# Altium schematic sheet Power_Supply.SchDoc
size A3; SheetNumber: 4; SheetTotal: 9
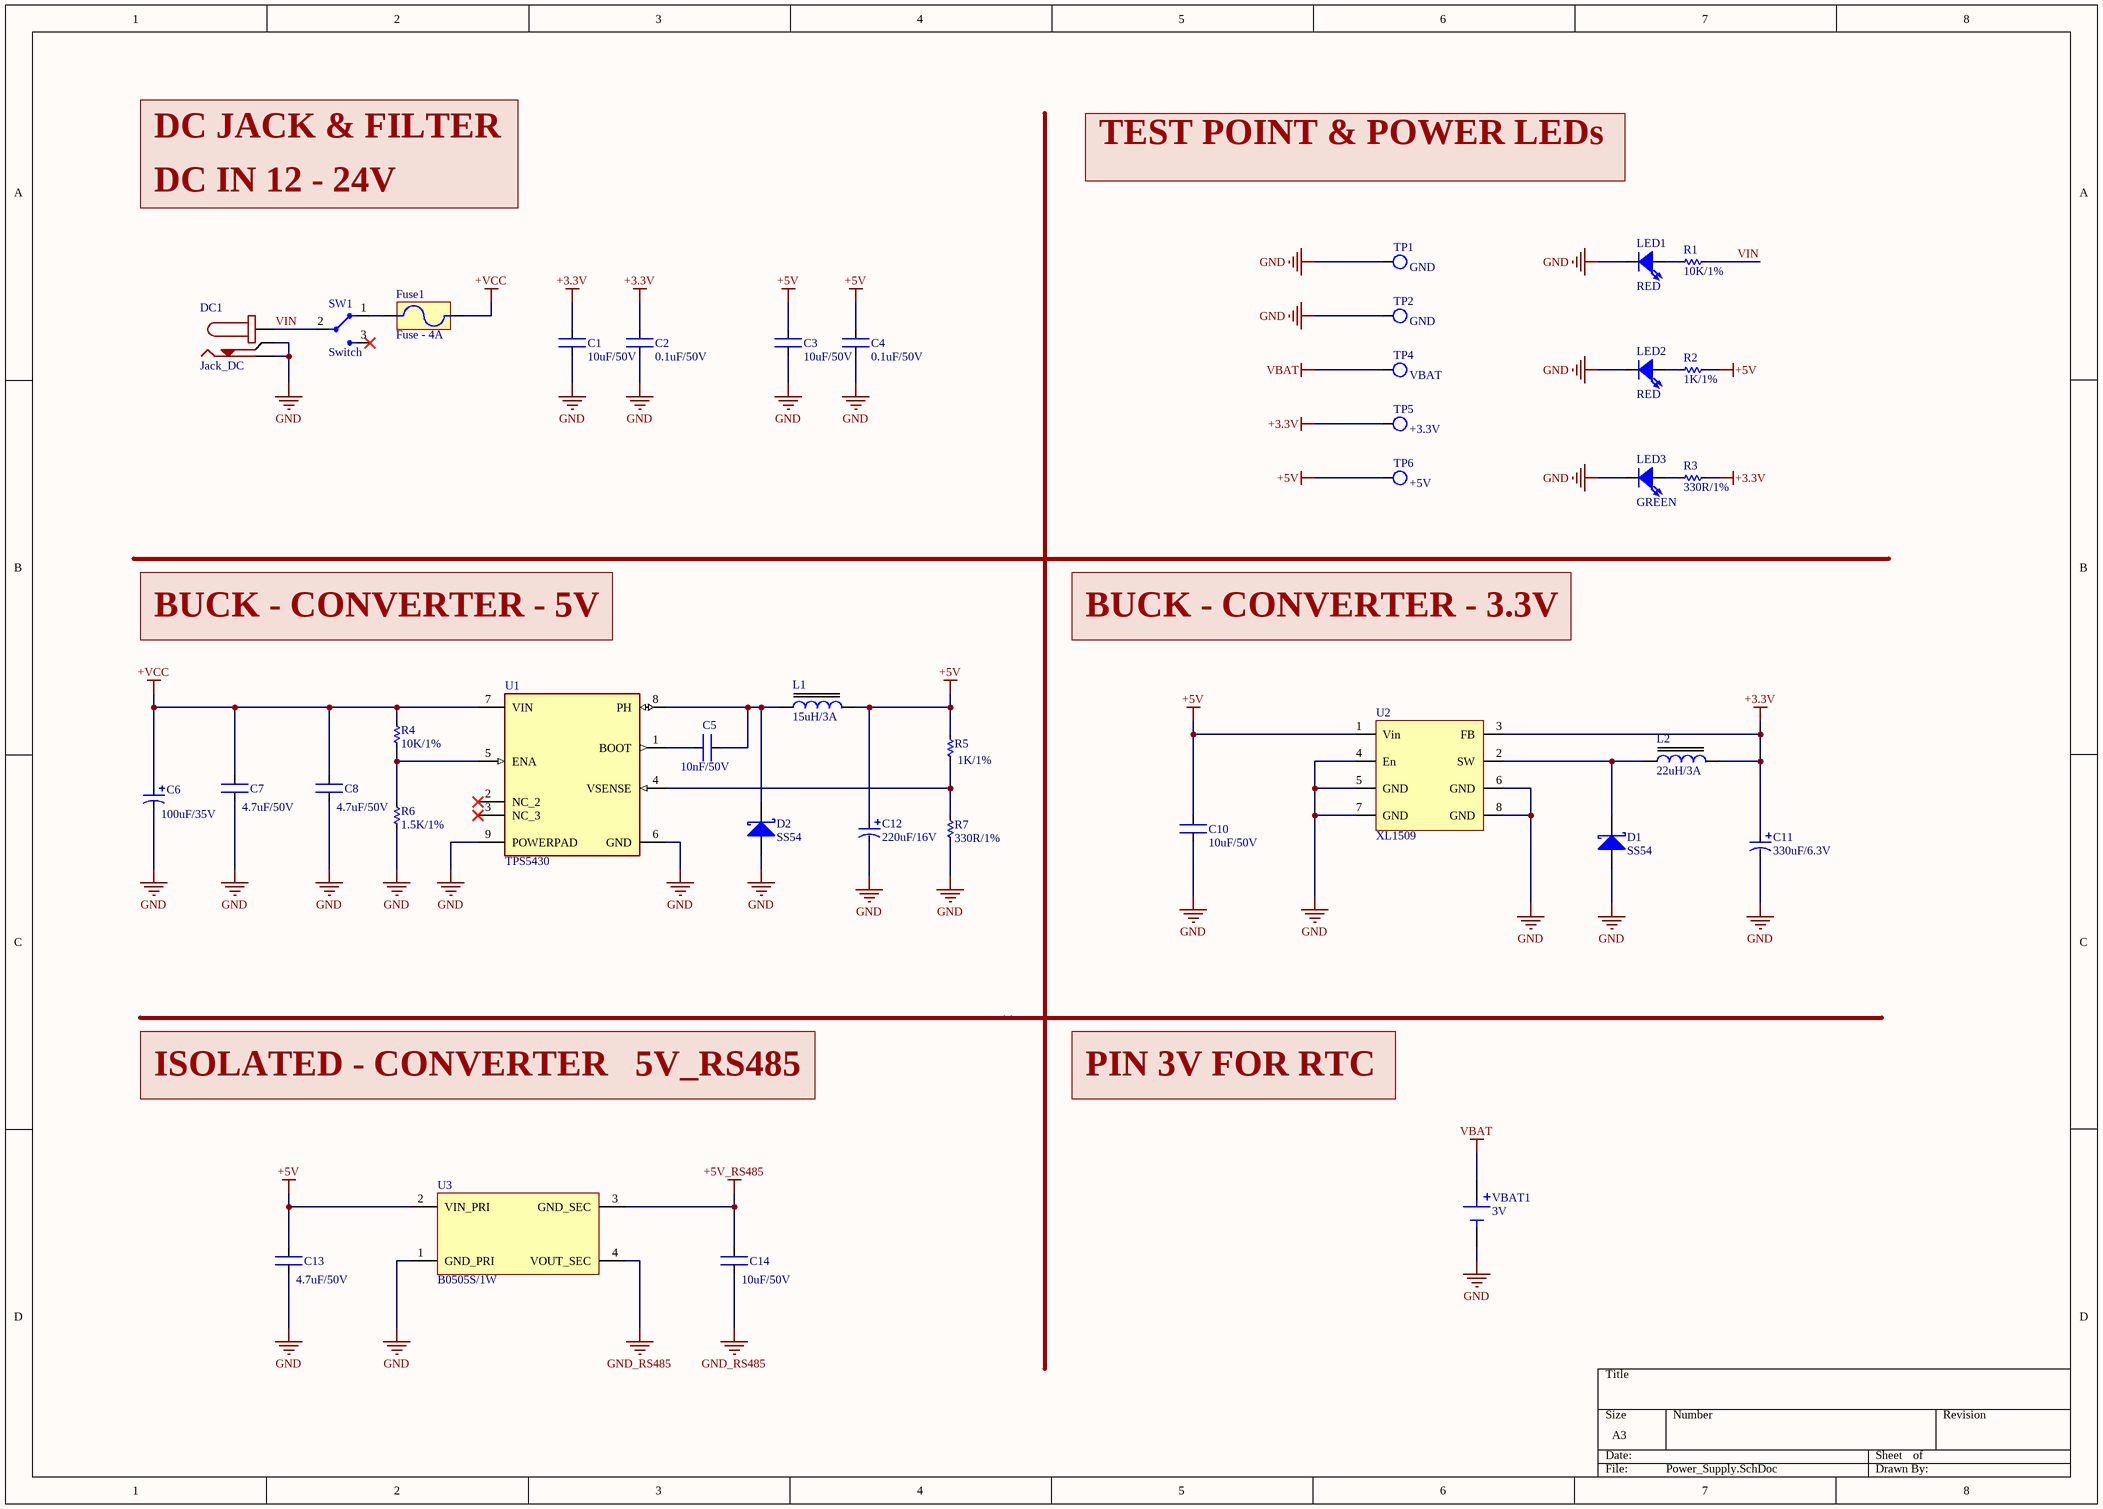
[diagram p0: Power_Supply.SchDoc]

## Parts
C1  10uF/50V  [CAP - 0603]
C2  0.1uF/50V  [CAP - 0603]
C3  10uF/50V  [CAP - 0603]
C4  0.1uF/50V  [CAP - 0603]
C5  10nF/50V  [CAP - 0603]
C6  100uF/35V  [Alu_Cap_6.3_7.7]
C7  4.7uF/50V  [CAP - 0603]
C8  4.7uF/50V  [CAP - 0603]
C10  10uF/50V  [CAP - 0603]
C11  330uF/6.3V  [Alu_Cap_6.3_7.7]
C12  220uF/16V  [Alu_Cap_6.3_7.7]
C13  4.7uF/50V  [CAP - 0603]
C14  10uF/50V  [CAP - 0603]
D1  SS54  [SS54]
D2  SS54  [SS54]
DC1  Jack_DC  [DC_5.5 x 2.1mm]
Fuse1  Fuse - 4A  [SMD-2]
L1  15uH/3A  [L_SMD_0630]
L2  22uH/3A  [L_SMD_0630]
LED1  RED  [RED_LED_0603]
LED2  RED  [RED_LED_0603]
LED3  GREEN  [GREEN_LED_0603]
R1  10K/1%  [RES - 0603]
R2  1K/1%  [RES - 0603]
R3  330R/1%  [RES - 0603]
R4  10K/1%  [RES - 0603]
R5  1K/1%  [RES - 0603]
R6  1.5K/1%  [RES - 0603]
R7  330R/1%  [RES - 0603]
SW1  Switch  [Dip_Switch_3_pins_0]
TP1  GND  [Test Point]
TP2  GND  [Test Point]
TP4  VBAT  [Test Point]
TP5  +3.3V  [Test Point]
TP6  +5V  [Test Point]
U1  TPS5430  [TPS5430]
U2  XL1509  [SOP_8]
U3  B0505S/1W  [B0505S/1W]
VBAT1  3V  [CR2032 - SMD]

## Nets
+3.3V: C1.1 C2.1 C11.1 L2.2 R3.1 TP5.1 U2.3(FB)
+5V: C3.1 C4.1 C10.1 C12.1 C13.1 L1.2 R2.1 R5.1 TP6.1 U2.1(Vin) U3.2(VIN_PRI)
+5V_RS485: C14.1 U3.3(GND_SEC)
+VCC: C6.1 C7.1 C8.1 Fuse1.2 R4.1 U1.7(VIN)
GND: C1.2 C2.2 C3.2 C4.2 C6.2 C7.2 C8.2 C10.2 C11.2 C12.2 C13.2 D1.1(A) D2.1(A) DC1.2(TN) DC1.3(T) LED1.2 LED2.2 LED3.2 R6.2 R7.2 TP1.1 TP2.1 U1.6(GND) U1.9(POWERPAD) U2.4(En) U2.5(GND) U2.6(GND) U2.7(GND) U2.8(GND) U3.1(GND_PRI) VBAT1.N(NEG)
GND_RS485: C14.2 U3.4(VOUT_SEC)
VBAT: TP4.1 VBAT1.P(POS)
VIN: DC1.1(S) R1.1 SW1.2
NetC5_1: C5.1 U1.1(BOOT)
NetC5_2: C5.2 D2.2(K) L1.1 U1.8(PH)
NetD1_2: D1.2(K) L2.1 U2.2(SW)
NetFuse1_1: Fuse1.1 SW1.1
NetLED1_1: LED1.1 R1.2
NetLED2_1: LED2.1 R2.2
NetLED3_1: LED3.1 R3.2
NetR4_2: R4.2 R6.1 U1.5(ENA)
NetR5_2: R5.2 R7.1 U1.4(VSENSE)

Not connected (* = marked no-connect by the designer): SW1 3(I/O2)*; U1 2(NC_2)* 3(NC_3)*

## Notes on the sheet
- DC JACK & FILTER
- TEST POINT & POWER LEDs
- DC IN 12 - 24V
- BUCK - CONVERTER - 5V
- BUCK - CONVERTER - 3.3V
- ISOLATED - CONVERTER   5V_RS485
- PIN 3V FOR RTC

## Library data of the parts
C1-C5 C7 C8 C10 C13 C14 = CAPACITOR: CAPACITOR SMD - KEMET
C6 C11 C12 = Alu_Capacitor
D1 D2 = SS54: DIODE SCHOTTKY 40V 5A SMA; Supplier 1: Newark; Supplier Part Number 1: 08X3002
DC1 = Jack_DC: Jack DC IN (Hole)
Fuse1 = Fuse: Nano2 SMD FF submin fuse w/holder, 4A | Littelfuse 0154004.DR
L1 L2 = Inductor_1_SMD
LED1-LED3 = LED_SMD: LED SMD
R1-R7 = RESISTOR: Resistor SMD - YAGEO
SW1 = Switch: Switch 3 Pins
TP1 TP2 TP4-TP6 = TEST POINT: Supplier Part Number 1: 36-5014-ND; Supplier 1: Digikey
U1 = TPS5430: Buck DC to DC Converter
U2 = XL1509: Buck Converter
U3 = B0505S/1W: Isolated - Converter
VBAT1 = Battery Base: Battery Base CR2032